# Altium schematic sheet USER_IO.SchDoc
size Tabloid; SheetNumber: 1; SheetTotal: 7
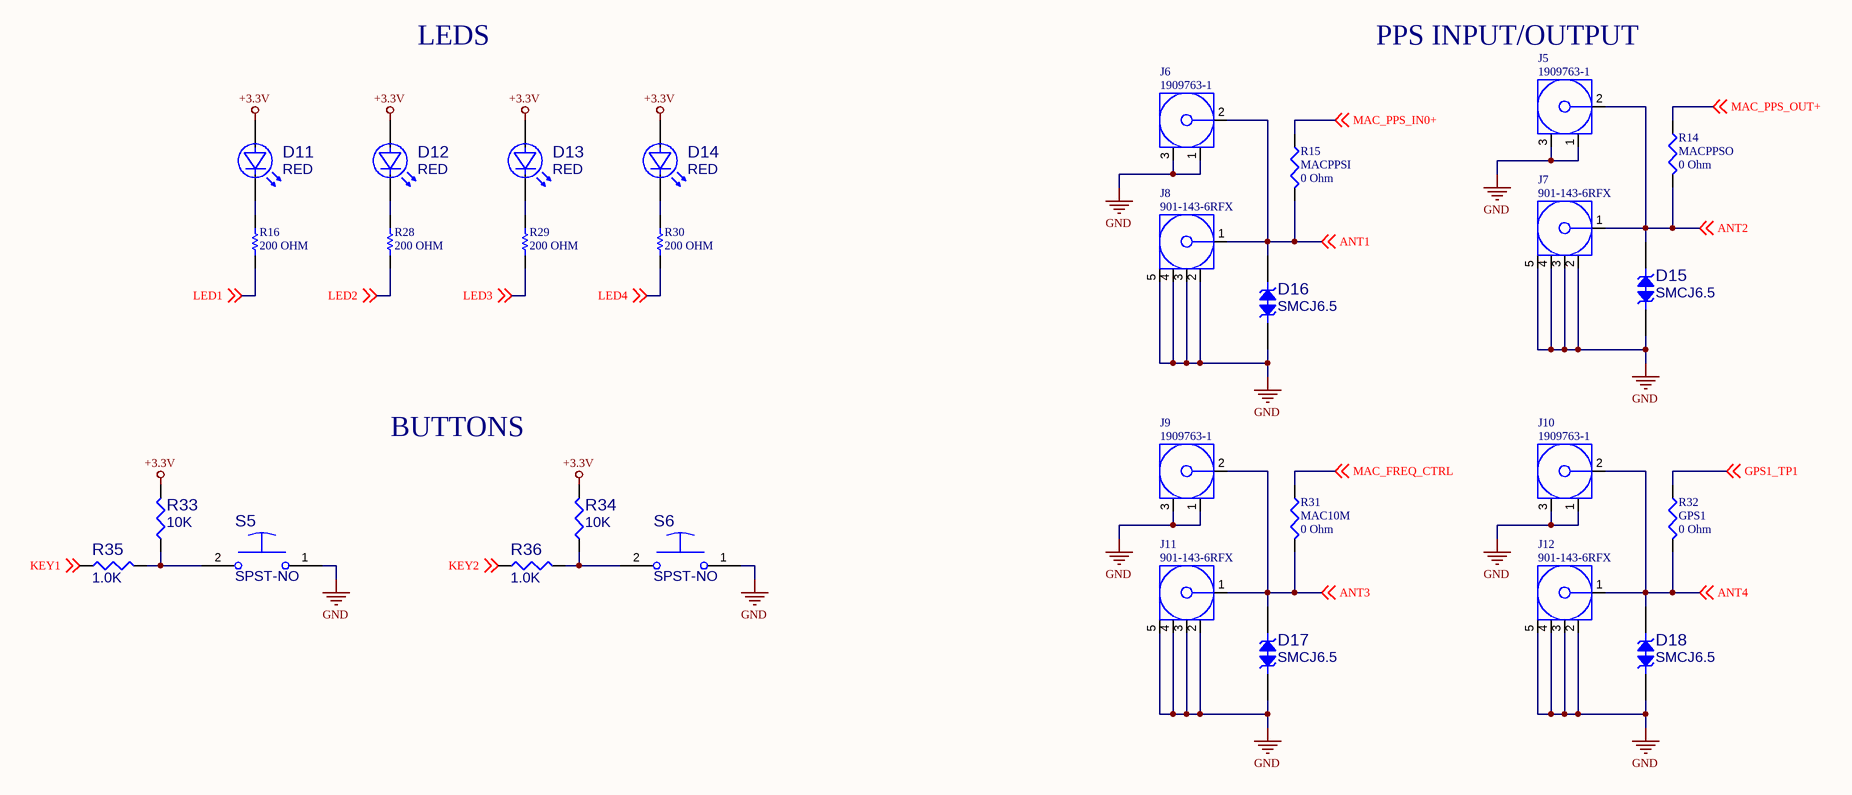
[diagram p0: USER_IO.SchDoc]

## Parts
D11  RED  [DIOM1608X06N]
D12  RED  [DIOM1608X06N]
D13  RED  [DIOM1608X06N]
D14  RED  [DIOM1608X06N]
D15  value SMCJ6.5  [DIOM6959X26N]  (hidden comment: SMCJ6.5CA)
D16  value SMCJ6.5  [DIOM6959X26N]  (hidden comment: SMCJ6.5CA)
D17  value SMCJ6.5  [DIOM6959X26N]  (hidden comment: SMCJ6.5CA)
D18  value SMCJ6.5  [DIOM6959X26N]  (hidden comment: SMCJ6.5CA)
J5  1909763-1  [TECO-1909763-1_V]
J6  1909763-1  [TECO-1909763-1_V]
J7  901-143-6RFX  [AMPH-901-143-6RFX_V]
J8  901-143-6RFX  [AMPH-901-143-6RFX_V]
J9  1909763-1  [TECO-1909763-1_V]
J10  1909763-1  [TECO-1909763-1_V]
J11  901-143-6RFX  [AMPH-901-143-6RFX_V]
J12  901-143-6RFX  [AMPH-901-143-6RFX_V]
R14  MACPPSO  value 0 Ohm  [J1-0603]
R15  MACPPSI  value 0 Ohm  [J1-0603]
R16  200 OHM  [RESC1608X55X30NL15T15]
R28  200 OHM  [RESC1608X55X30NL15T15]
R29  200 OHM  [RESC1608X55X30NL15T15]
R30  200 OHM  [RESC1608X55X30NL15T15]
R31  MAC10M  value 0 Ohm  [J1-0603]
R32  GPS1  value 0 Ohm  [J1-0603]
R33  value 10K  [RESC1608X50N]  (hidden comment: ERJ-3EKF1002V)
R34  value 10K  [RESC1608X50N]  (hidden comment: ERJ-3EKF1002V)
R35  value 1.0K  [RESC1608X50N]  (hidden comment: ERJ-3EKF1001V)
R36  value 1.0K  [RESC1608X50N]  (hidden comment: ERJ-3EKF1001V)
S5  value SPST-NO  [OMRON-B3U-1000P]  (hidden comment: B3U-1000P)
S6  value SPST-NO  [OMRON-B3U-1000P]  (hidden comment: B3U-1000P)

## Nets
+3.3V: D11.2(A) D12.2(A) D13.2(A) D14.2(A) R33.2 R34.2
GND: D15.K D16.K D17.K D18.K J5.1 J5.3 J6.1 J6.3 J7.2 J7.3 J7.4 J7.5 J8.2 J8.3 J8.4 J8.5 J9.1 J9.3 J10.1 J10.3 J11.2 J11.3 J11.4 J11.5 J12.2 J12.3 J12.4 J12.5 S5.1 S6.1
ANT1: D16.A J6.2 J8.1 R15.2 ; off-sheet ANT1
ANT2: D15.A J5.2 J7.1 R14.2 ; off-sheet ANT2
ANT3: D17.A J9.2 J11.1 R31.2 ; off-sheet ANT3
ANT4: D18.A J10.2 J12.1 R32.2 ; off-sheet ANT4
GPS1_TP1: R32.1 ; off-sheet GPS1_TP1
KEY1: R35.1 ; off-sheet KEY1
KEY2: R36.1 ; off-sheet KEY2
LED1: R16.1 ; off-sheet LED1
LED2: R28.1 ; off-sheet LED2
LED3: R29.1 ; off-sheet LED3
LED4: R30.1 ; off-sheet LED4
MAC_FREQ_CTRL: R31.1 ; off-sheet MAC_FREQ_CTRL
MAC_PPS_IN0+: R15.1 ; off-sheet MAC_PPS_IN0+
MAC_PPS_OUT+: R14.1 ; off-sheet MAC_PPS_OUT+
NetD11_1: D11.1(K) R16.2
NetD12_1: D12.1(K) R28.2
NetD13_1: D13.1(K) R29.2
NetD14_1: D14.1(K) R30.2
NetR33_1: R33.1 R35.2 S5.2
NetR34_1: R34.1 R36.2 S6.2

## Notes on the sheet
- LEDS
- PPS INPUT/OUTPUT
- BUTTONS
- SHEET
- timingcard.com <http://timingcard.com>
- OF

## Library data of the parts
D11-D14 = SMTLED_RED_0603_SML: LED, RED, SML-LX0603, 635NM, 2V, 20MA, 0603; MFG PART NUM: SML-LX0603IW-TR; VALENTIUM PART NUM: <VALENTIUM>; MFG NAME: LUMEX; MAXTEMP: 85C; MINTEMP: -25C; MODIFY DATE: 9/4/2013; CATEGORY: LED; OTHER: SML-LX0603; P1: 635NM; P2: 2V; P3: 20MA; SIZE: 0603; SHEETPART: *; DESC: LED, RED, SML-LX0603, 635NM, 2V, 20MA, 0603; Supplier 1: Digi-Key; Supplier Part Number 1: 67-1548-1-ND; VALUE: RED
D15-D18 = SMCJ6.5CA: DIO, TVS, SMCJ6.5, 6.5V, BIDIR, 1.5KW, SMC; VALENTIUM PART NUM: <VALENTIUM>; MFG NAME: LITTELFUSE; MAXTEMP: 150C; MINTEMP: -55C; OTHER: SMCJ; MFG PART NUM: SMCJ6.5CA; MODIFY DATE: 9/4/2013; CATEGORY: DIO, TVS; P1: 6.5V; P2: BIDIR; P3: 1.5KW; SIZE: SMC; SHEETPART: *; Supplier 1: Digi-Key; Supplier Part Number 1: SMCJ6.5CALFCT-ND; DESC: DIO, TVS, SMCJ6.5, 6.5V, BIDIR, 1.5KW, SMC
J5 J6 J9 J10 = CMP-2000-07505-1: Ultra Miniature Coaxial Connector Jack, 60 V, 50 Ohm, -40 to 90 degC, RoHS, Tape and Reel; Manufacturer: TE Connectivity; Gender: Female; PCB Mounting Orientation: Vertical; Body Material: LiquidCrystalPolymer; Case\/Package: SMD/SMT; Impedance: 50Ohm; Max Frequency: 6GHz; Body Plating: Gold; Dielectric Material: Polymer; Orientation: Straight; Mount: SurfaceMount; Length: 3mm; Packaging: TapeandReel; Connector Type: Jack; Lead Free: LeadFree; Package Quantity: 1; Termination: SMD/SMT; Contact Material: CopperAlloy; Fastening Type: Pull; RoHSCompliant: true; Max Operating Temperature: 90degC; Datasheet URL: http://www.te.com/commerce/DocumentDelivery/DDEController?Action=srchrtrv&DocNm=1909763&DocType=Customer+Drawing&DocLang=English; Contact Plating: Gold; Mounting Technology: SurfaceMount; Package Reference: TECO-1909763-1; Insulation Material: Thermoplastic; Min Operating Temperature: -40degC; Manufacturer URL: http://www.te.com/; ELV: Compliant; Datasheet Version: Rev. B2, 11/2015; Radiation Hardening: No; Package Description: 3-Pin Surface Mount Device, Body 2.6 x 2.6 mm; Housing Colour: Beige
J7 J8 J11 J12 = CMP-2000-05705-1: Coaxial connector, 50 Ohm, -65 to 165 degC, 5-Pin THD, RoHS, Bulk; Manufacturer: Amphenol; Catalog Drawings: 901-143-6RFXMountingHole; 3D Model: 901-143-6RFX.igs; Body Material: Brass; Connector Type: Jack,FemaleSocket; Shield Termination: Solder; Other Names: 901-143-6-RFX9011436RFXARFX1232; Online Catalog: SMA,RFX; Frequency - Max: 18GHz; Body Finish: Gold; Dielectric Material: Polytetrafluoroethylene(PTFE); Center Contact Material: BerylliumCopper; Impedance: 50Ohm; Connector Style: SMA; Mounting Technology: ThroughHole; Mounting Type: ThroughHole,RightAngle; Cable Group: -; Series: -; Package Description: 5-Pin Through Hole Device, Body 7 x 7 mm, Pitch 2.54 mm; Package Reference: 901-143-6RFX; Voltage Rating: -; Standard Package: 1; Fastening Type: Threaded; Housing Color: Gold; Datasheet URL: http://www.amphenolrf.com/downloads/dl/file/id/2712/product/3102/901_143_6rfx_customer_drawing.pdf; Family: CoaxialConnectors(RF); Contact Termination: Solder; Manufacturer URL: http://www.amphenol.com/; Operating Temperature: -65°C~165°C; Category: Connectors,Interconnects; Packaging: Bulk; Features: -; Center Contact Plating: Gold; Datasheet Version: Rev. C, 06/2010; Ingress Protection: -
R14 R15 R31 R32 = Res3: Resistor; Published: 8-Jun-2000; LatestRevisionDate: 29-May-2009; LatestRevisionNote: IPC-7351 Footprint Added.; PackageReference: J1-0603; Publisher: Altium Limited; PackageDescription: Chip Resistor
R16 R28-R30 = CMP-2000-00316-1: ERJ-3EKF2000V; Manufacturer: Panasonic; Part Number: ERJ-3EKF2000V
R33 R34 = RES_0603_10K: RES, 10K, 1%, 1/10W, TF, 0603; VELENTIUM PART NUM: <VELENTIUM>; MFG NAME: PANASONIC; MAXTEMP: 125C; MINTEMP: -55C; OTHER: 100PPM; SUB: GENERIC; ModifyDate: 7/25/2013; MFG PART NUM: ERJ-3EKF1002V; CATEGORY: RES; Date: 7/26/2013; P1: 1%; P3: TF; P2: 1/10W; SIZE: 0603; Supplier 1: Digi-Key; Supplier Part Number 1: P10.0KHCT-ND; SHEETPART: *; DESC: RES, 10K, 1%, 1/10W, TF, 0603
R35 R36 = RES_0603_1.0K: RES, 1.0K, 1%, 1/10W, TF, 0603; VELENTIUM PART NUM: <VELENTIUM>; MFG NAME: PANASONIC; MAXTEMP: 125C; MINTEMP: -55C; OTHER: 100PPM; SUB: GENERIC; ModifyDate: 7/25/2013; MFG PART NUM: ERJ-3EKF1001V; CATEGORY: RES; Date: 7/26/2013; P1: 1%; P3: TF; P2: 1/10W; SIZE: 0603; Supplier 1: Digi-Key; Supplier Part Number 1: P1.00KHCT-ND; SHEETPART: *; DESC: RES, 1.0K, 1%, 1/10W, TF, 0603
S5 S6 = B3U-1000P: SW, SPST-NO, TACT, 12V, 50MA, 3X2.5MM SMT, B3U SERIES; VALENTIUM PART NUM: <VALENTIUM>; MFG NAME: OMRON; MAXTEMP: 70C; MINTEMP: -25C; MFG PART NUM: B3U-1000P; MODIFY DATE: 9/5/2013; CATEGORY: SW; OTHER: B3U SERIES; P1: 12V; P2: 50mA; P3: TACT; SIZE: 3X2.5MM; SHEETPART: *; DESC: SW, SPST-NO, TACT, 12V, 50MA, 3X2.5MM SMT, B3U SERIES; Supplier 1: Digi-Key; Supplier Part Number 1: SW1020CT-ND